# EAGLE schematic V4-AddOnESP32-V001-komplett (EAGLE 9.3.0)
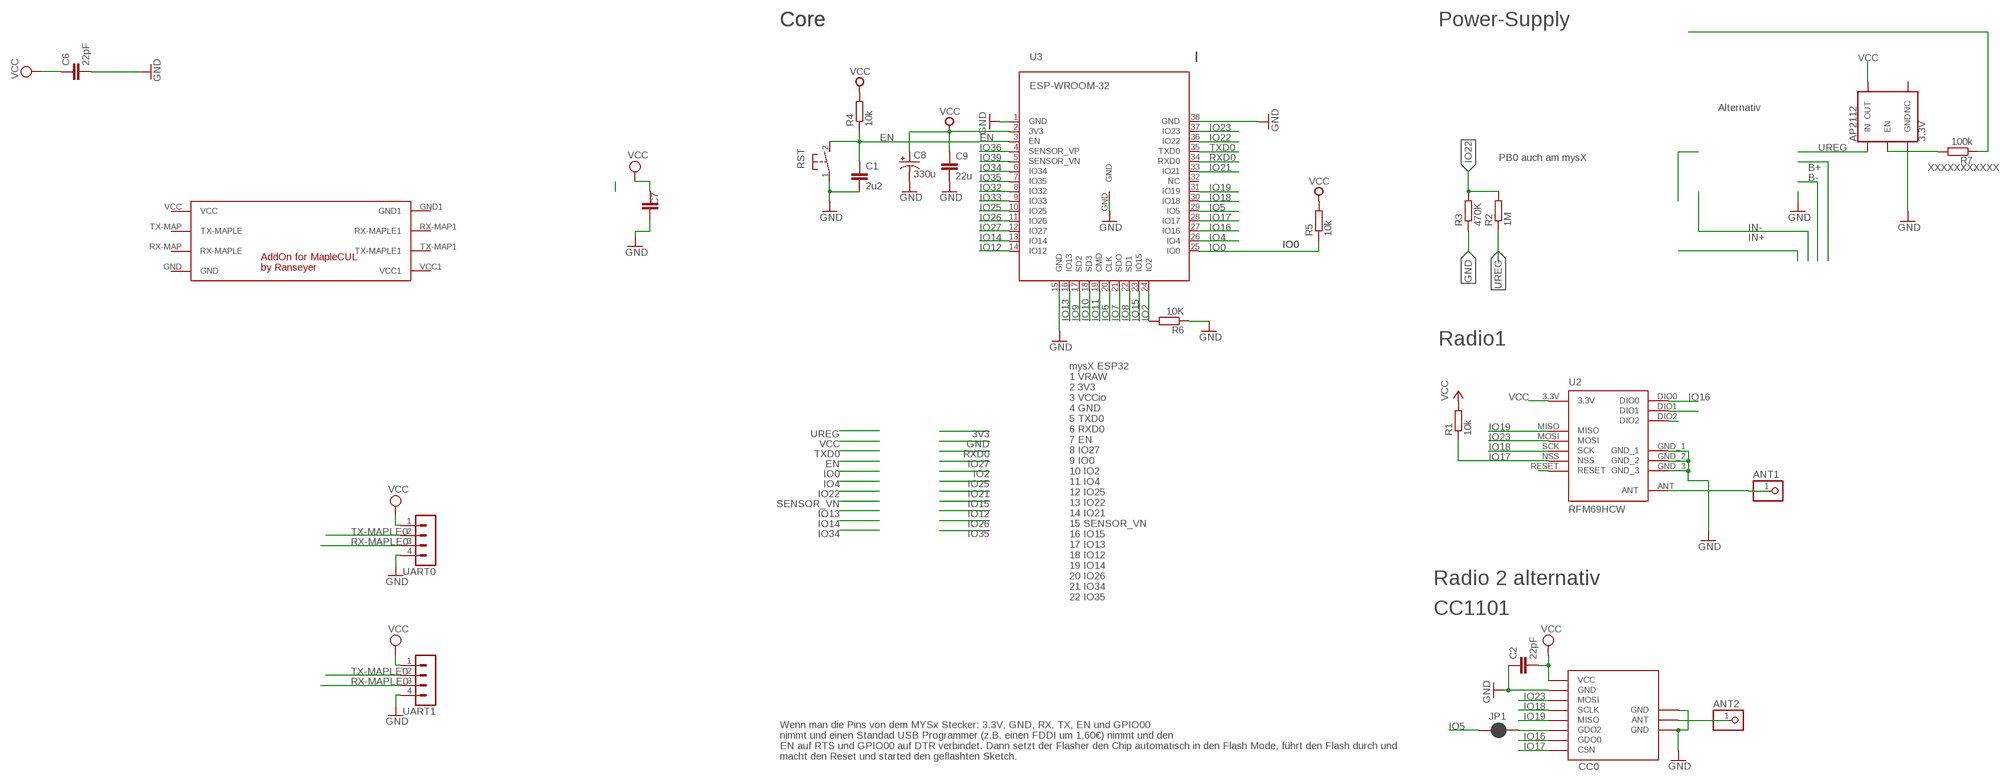
[diagram p0: schematic, sheet 1]

## Parts
ANT1  PINHD-1X1  [1X01]
ANT2  PINHD-1X1  [1X01]
AP2112  3.3V  V_REG_AP2112K-3.3V  [SOT23-5]
C1  2u2  C-EUC0805  [C0805]
C2  22pF  C-EUC0805  [C0805]
C6  22pF  C-EUC0805  [C0805]
C7  C-EUC1812  [C1812]
C8  330u  CAP_POLSMD  [VISHAY_C]
C9  22u  C-EUC0805  [C0805]
CC0  CC1101  CC1101_MODULE1SMD  [CC1101_MODULE1_SMD]
JP1  JUMPER-SMT_2_NC_PASTE_NO-SILK  [SMT-JUMPER_2_NC_PASTE_NO-SILK]
R1  10k  R-EU_M0805  [M0805]
R2  1M  R-EU_M0805  [M0805]
R3  470K  R-EU_M0805  [M0805]
R4  10k  R-EU_M0805  [M0805]
R5  10k  R-EU_R0603  [R0603]
R6  10K  R-EU_M0805  [M0805]
R7  100k  R-EU_M0805  [M0805]
RST  DTSM-3  [DTSM-3]
U2  RFM69HCW  [RFM69HCW-XXXS2]
U3  ESP-WROOM-32  [ESP-WROOM-32]
U$1  MAPLE-CUL-ADDON-V01  [MAPLE-CUL-V01]
UART0  MA04-1  [MA04-1]
UART1  MA04-1  [MA04-1]

## Nets
ANT0: ANT2.1 CC0.ANT
ANT1: ANT1.1 U2.ANT
EN: C1.1 R4.1 RST.2 U3.3(EN)
GND [gnd]: AP2112.2(GND) C1.2 C2.1 C6.2 C7.1 C8.- C9.2 CC0.GND@0(GND) CC0.GND@1(GND) CC0.GND@2(GND) R3.1 R6.1 RST.1 U2.GND_1 U2.GND_2 U2.GND_3 U3.1(GND) U3.15(GND) U3.38(GND) U3.GND UART0.4 UART1.4
IN++ [vcc]: R7.1
IO0: R5.1 U3.25(IO0)
IO2: R6.2 U3.24(IO2)
IO4: U3.26(IO4)
IO5: JP1.1 U3.29(IO5)
IO6: U3.20(CLK)
IO7: U3.21(SDO)
IO8: U3.22(SD1)
IO9: U3.17(SD2)
IO10: U3.18(SD3)
IO11: U3.19(CMD)
IO12: U3.14(IO12)
IO13: U3.16(IO13)
IO14: U3.13(IO14)
IO15: U3.23(IO15)
IO16: CC0.GDO0 U2.DIO0 U3.27(IO16)
IO17: CC0.CSN R1.1 U2.NSS U3.28(IO17)
IO18: CC0.SCLK U2.SCK U3.30(IO18)
IO19: CC0.MISO U2.MISO U3.31(IO19)
IO21: U3.33(IO21)
IO22: R2.2 R3.2 U3.36(IO22)
IO23: CC0.MOSI U2.MOSI U3.37(IO23)
IO25: U3.10(IO25)
IO26: U3.11(IO26)
IO27: U3.12(IO27)
IO32: U3.8(IO32)
IO33: U3.9(IO33)
IO34: U3.6(IO34)
IO35: U3.7(IO35)
IO36: U3.4(SENSOR_VP)
IO39: U3.5(SENSOR_VN)
MAYBE_IO5: CC0.GDO2 JP1.2
N$4: U2.DIO2
N$8: U2.DIO1
N$9: U2.RESET
N$12: AP2112.3(EN) R7.2
RX-MAPLE0: UART0.3 UART1.3
RXD0: U3.34(RXD0)
TX-MAPLE0: UART0.2 UART1.2
TXD0: U3.35(TXD0)
UREG [gnd]: AP2112.1(IN) R2.1
VCC [gnd]: AP2112.5(OUT) C2.2 C6.1 C7.2 C8.+ C9.1 CC0.VCC R1.2 R4.2 R5.2 U2.3.3V U3.2(3V3) UART0.1 UART1.1
Unconnected: AP2112.4(NC) U3.32(NC) U$1.GND U$1.GND1 U$1.RX-MAP1(RX-MAPLE1) U$1.RX-MAP(RX-MAPLE) U$1.TX-MAP1(TX-MAPLE1) U$1.TX-MAP(TX-MAPLE) U$1.VCC U$1.VCC1

## Notes on the sheet
- Core | Core | Power-Supply
- Alternativ
- PB0 auch am mysX
- XXXXXXXXXXX
- Radio1
- Radio 2 alternativ
- mysX ESP32
  1 VRAW
  2 3V3
  3 VCCio
  4 GND
  5 TXD0
  6 RXD0
  7 EN
  8 IO27
  9 IO0
  10 IO2
  11 IO4
  12 IO25
  13 IO22
  14 IO21
  15 SENSOR_VN
  16 IO15
  17 IO13
  18 IO12
  19 IO14
  20 IO26
  21 IO34
  22 IO35
- CC1101
- Wenn man die Pins von dem MYSx Stecker: 3.3V, GND, RX, TX, EN und GPIO00
  nimmt und einen Standad USB Programmer (z.B. einen FDDI um 1,60€) nimmt und den
  EN auf RTS und GPIO00 auf DTR verbindet. Dann setzt der Flasher den Chip automatisch in den Flash Mode, führt den Flash durch und
  macht den Reset und started den geflashten Sketch.

## Library data of the parts
ANT1 ANT2 = pinhead:PINHD-1X1: PIN HEADER
AP2112 = SparkFun-IC-Power:V_REG_AP2112: AP2112 - 600mA CMOS LDO Regulator w/ Enable The AP2112 is CMOS process low dropout linear regulator with enable function, the regulator delivers a guaranteed 600mA (min.) continuous load current. Features Output Voltage Accuracy: ±1.5% Output Current: 600mA (Min.) Foldback Short Current Protection: 50mA Enable Function to Turn ON/OFF VOUT Low Dropout Voltage (3.3V): 250mV (Typ.) @IOUT=600mA Excellent Load Regulation: 0.2%/A (Typ.) Excellent Line Regulation: 0.02%/V (Typ.) Low Quiescent Current: 55μA (Typ.) Low Standby Current: 0.01μA (Typ.) Low Output Noise: 50μVRMS PSRR: 100Hz -65dB, 1kHz -65dB OTSD Protection Stable with 1.0μF Flexible Cap: Ceramic, Tantalum and Aluminum Electrolytic Operation Temperature Range: -40°C to 85°C ESD: MM 400V, HBM 4000V; PROD_ID: VREG-12457
C1 C9 = rcl@1:C-EU: CAPACITOR, European symbol; SPICEPREFIX: C
C2 = rcl:C-EU: CAPACITOR, European symbol
C6 C7 = rcl:C-EU: CAPACITOR, European symbol; SPICEPREFIX: C
C8 = SparkFun-Passives:CAP_POL: Capacitor Polarized These are standard SMD and PTH capacitors. Normally 10uF, 47uF, and 100uF in electrolytic and tantalum varieties. Always verify the external diameter of the through hole cap, it varies with capacity, voltage, and manufacturer. The EIA devices should be standard.
CC0 = wireless:CC1101_MODULE1: CC1101 wireless module for 433/868 MHz (sold from Aliexpress). DIL version for mounting with pin header (and SMD soldering) and SMD only variant available.
JP1 = SparkFun-Jumpers:JUMPER-SMT_2_NC_PASTE: Normally closed solder jumper This jumper has an aperture in the stencil to allow solder paste to bridge the split in the wire so it's normally closed (NC). Wick off the solder to open the connection. Reapply solder to reclose the connection.
R1-R3 R5-R7 = rcl:R-EU_: RESISTOR, European symbol
R4 = rcl@1:R-EU_: RESISTOR, European symbol; SPICEPREFIX: R
RST = switch-tact:DTSM-3
U2 = doug:RFM69H
U3 = esp32:ESP-WROOM-32
U$1 = Martin-Communication-V4:MAPLE-CUL-ADDON-V01: AddOn for MAPLE-CUL V4.x
UART0 UART1 = con-lstb:MA04-1: PIN HEADER; OC_FARNELL: unknown; OC_NEWARK: unknown

## Net classes
0 default: width 0.305 mm, clearance 0.205 mm
1 gnd: width 0.457 mm, drill 0.635 mm, clearance 0.254 mm
2 vcc: width 0.406 mm, drill 0.406 mm, clearance 0.254 mm